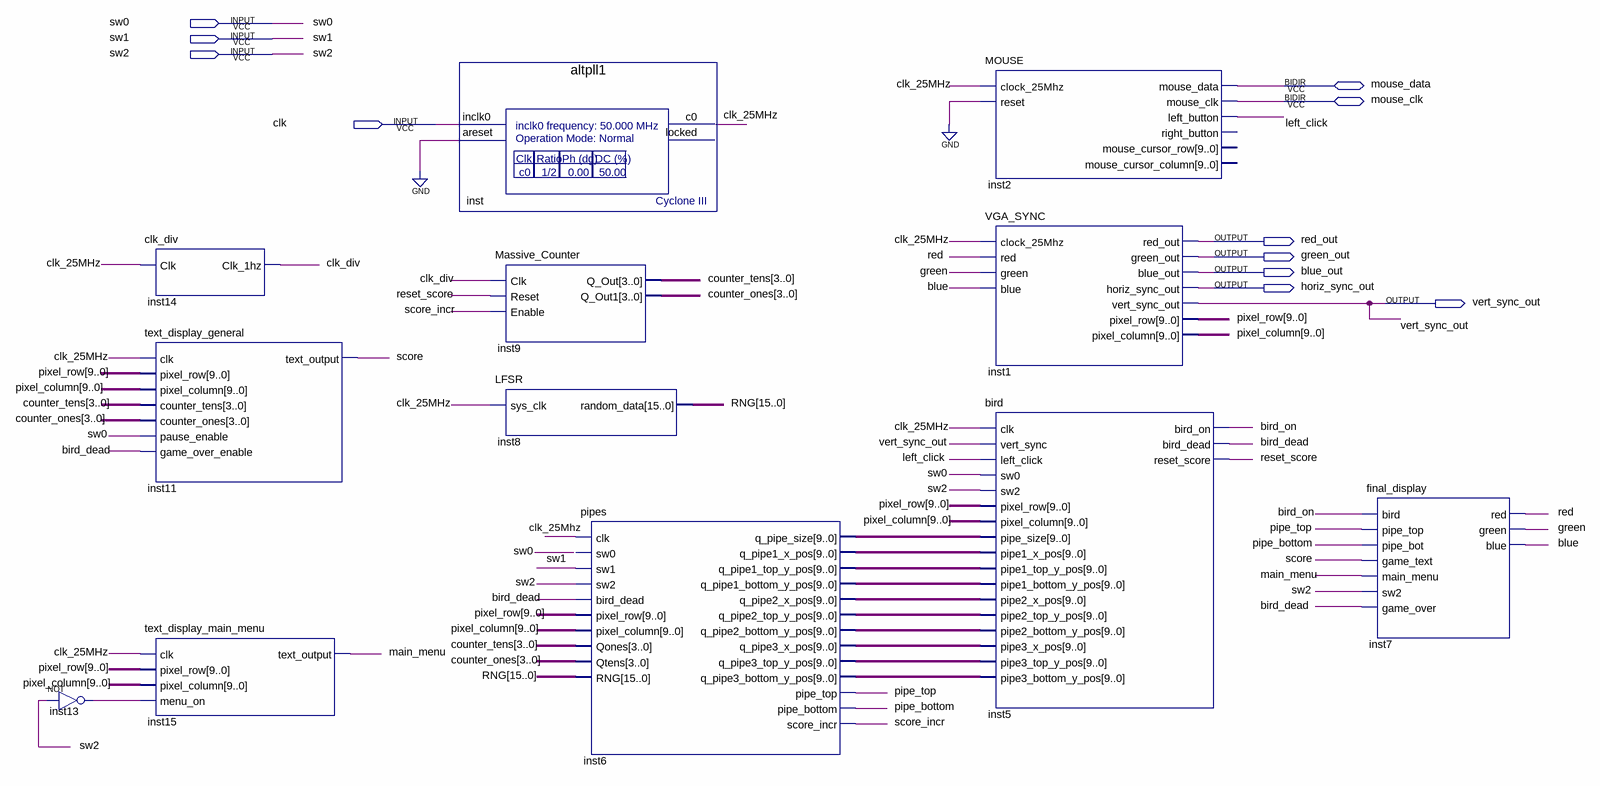
[diagram p0: schematic sheet]
// Quartus schematic FlappyBird-FlappyCompsys.bdf as structural Verilog: 12 symbols, 11 pins
module \FlappyBird-FlappyCompsys  (
  input  sw0,
  input  sw1,
  input  sw2,
  input  clk,
  inout  mouse_data,
  inout  mouse_clk,
  output red_out,
  output green_out,
  output blue_out,
  output horiz_sync_out,
  output vert_sync_out
);

  wire bird_dead, bird_on, blue, clk_25MHz, clk_div, green, inst13_out, left_click, main_menu, pipe_bottom,
       pipe_top, red, reset_score, score, score_incr;
  wire [3:0] counter_ones, counter_tens;
  wire [9:0] inst6_q_pipe1_bottom_y_pos, inst6_q_pipe1_top_y_pos, inst6_q_pipe1_x_pos,
       inst6_q_pipe2_bottom_y_pos, inst6_q_pipe2_top_y_pos, inst6_q_pipe2_x_pos, inst6_q_pipe3_bottom_y_pos,
       inst6_q_pipe3_top_y_pos, inst6_q_pipe3_x_pos, inst6_q_pipe_size, pixel_column, pixel_row;
  wire [15:0] RNG;

  not inst13 (inst13_out, sw2);
  clk_div inst14 (.Clk(clk_25MHz), .Clk_1hz(clk_div));
  text_display_general inst11 (
    .clk(clk_25MHz), .pixel_row(pixel_row), .pixel_column(pixel_column), .counter_tens(counter_tens),
    .counter_ones(counter_ones), .pause_enable(sw0), .game_over_enable(bird_dead), .text_output(score));
  text_display_main_menu inst15 (
    .clk(clk_25MHz), .pixel_row(pixel_row), .pixel_column(pixel_column), .menu_on(inst13_out),
    .text_output(main_menu));
  altpll1 inst (.inclk0(clk), .areset(1'b0), .c0(clk_25MHz));  // open: locked
  Massive_Counter inst9 (
    .Clk(clk_div), .Reset(reset_score), .Enable(score_incr), .Q_Out(counter_tens), .Q_Out1(counter_ones));
  LFSR inst8 (.sys_clk(clk_25MHz), .random_data(RNG));
  pipes inst6 (
    .clk(clk_25MHz), .sw1(sw1), .sw2(sw2), .bird_dead(bird_dead), .pixel_row(pixel_row),
    .pixel_column(pixel_column), .Qones(counter_tens), .Qtens(counter_ones), .RNG(RNG),
    .q_pipe_size(inst6_q_pipe_size), .q_pipe1_x_pos(inst6_q_pipe1_x_pos),
    .q_pipe1_top_y_pos(inst6_q_pipe1_top_y_pos), .q_pipe1_bottom_y_pos(inst6_q_pipe1_bottom_y_pos),
    .q_pipe2_x_pos(inst6_q_pipe2_x_pos), .q_pipe2_top_y_pos(inst6_q_pipe2_top_y_pos),
    .q_pipe2_bottom_y_pos(inst6_q_pipe2_bottom_y_pos), .q_pipe3_x_pos(inst6_q_pipe3_x_pos),
    .q_pipe3_top_y_pos(inst6_q_pipe3_top_y_pos), .q_pipe3_bottom_y_pos(inst6_q_pipe3_bottom_y_pos),
    .pipe_top(pipe_top), .pipe_bottom(pipe_bottom), .score_incr(score_incr));  // open: sw0
  MOUSE inst2 (
    .clock_25Mhz(clk_25MHz), .reset(1'b0), .left_button(left_click), .mouse_data(mouse_data),
    .mouse_clk(mouse_clk));  // open: right_button, mouse_cursor_row, mouse_cursor_column
  VGA_SYNC inst1 (
    .clock_25Mhz(clk_25MHz), .red(red), .green(green), .blue(blue), .red_out(red_out), .green_out(green_out),
    .blue_out(blue_out), .horiz_sync_out(horiz_sync_out), .vert_sync_out(vert_sync_out),
    .pixel_row(pixel_row), .pixel_column(pixel_column));
  bird inst5 (
    .clk(clk_25MHz), .vert_sync(vert_sync_out), .left_click(left_click), .sw0(sw0), .sw2(sw2),
    .pixel_row(pixel_row), .pixel_column(pixel_column), .pipe_size(inst6_q_pipe_size),
    .pipe1_x_pos(inst6_q_pipe1_x_pos), .pipe1_top_y_pos(inst6_q_pipe1_top_y_pos),
    .pipe1_bottom_y_pos(inst6_q_pipe1_bottom_y_pos), .pipe2_x_pos(inst6_q_pipe2_x_pos),
    .pipe2_top_y_pos(inst6_q_pipe2_top_y_pos), .pipe2_bottom_y_pos(inst6_q_pipe2_bottom_y_pos),
    .pipe3_x_pos(inst6_q_pipe3_x_pos), .pipe3_top_y_pos(inst6_q_pipe3_top_y_pos),
    .pipe3_bottom_y_pos(inst6_q_pipe3_bottom_y_pos), .bird_on(bird_on), .bird_dead(bird_dead),
    .reset_score(reset_score));
  final_display inst7 (
    .bird(bird_on), .pipe_top(pipe_top), .pipe_bot(pipe_bottom), .game_text(score), .main_menu(main_menu),
    .sw2(sw2), .game_over(bird_dead), .red(red), .green(green), .blue(blue));
endmodule
